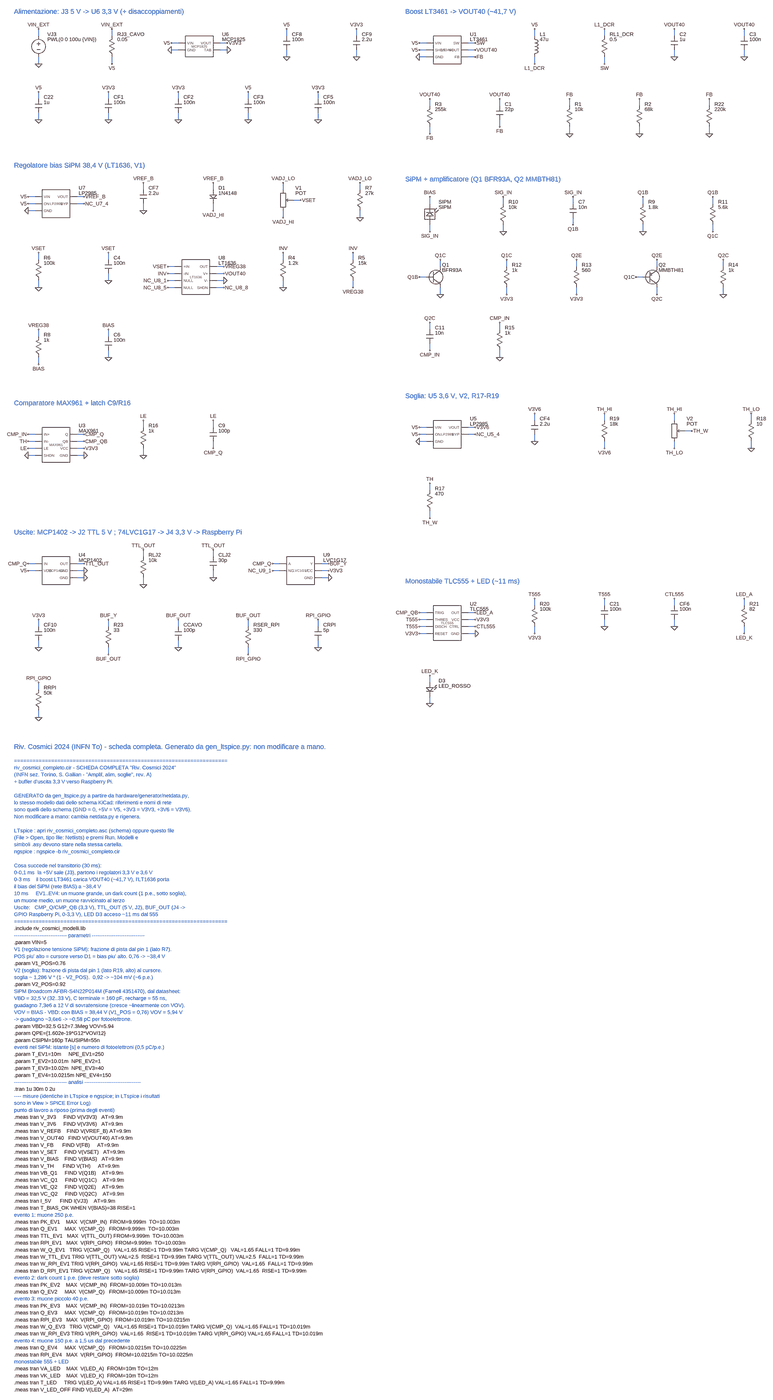
[diagram p0: schematic riv_cosmici_completo.asc, whole sheet]
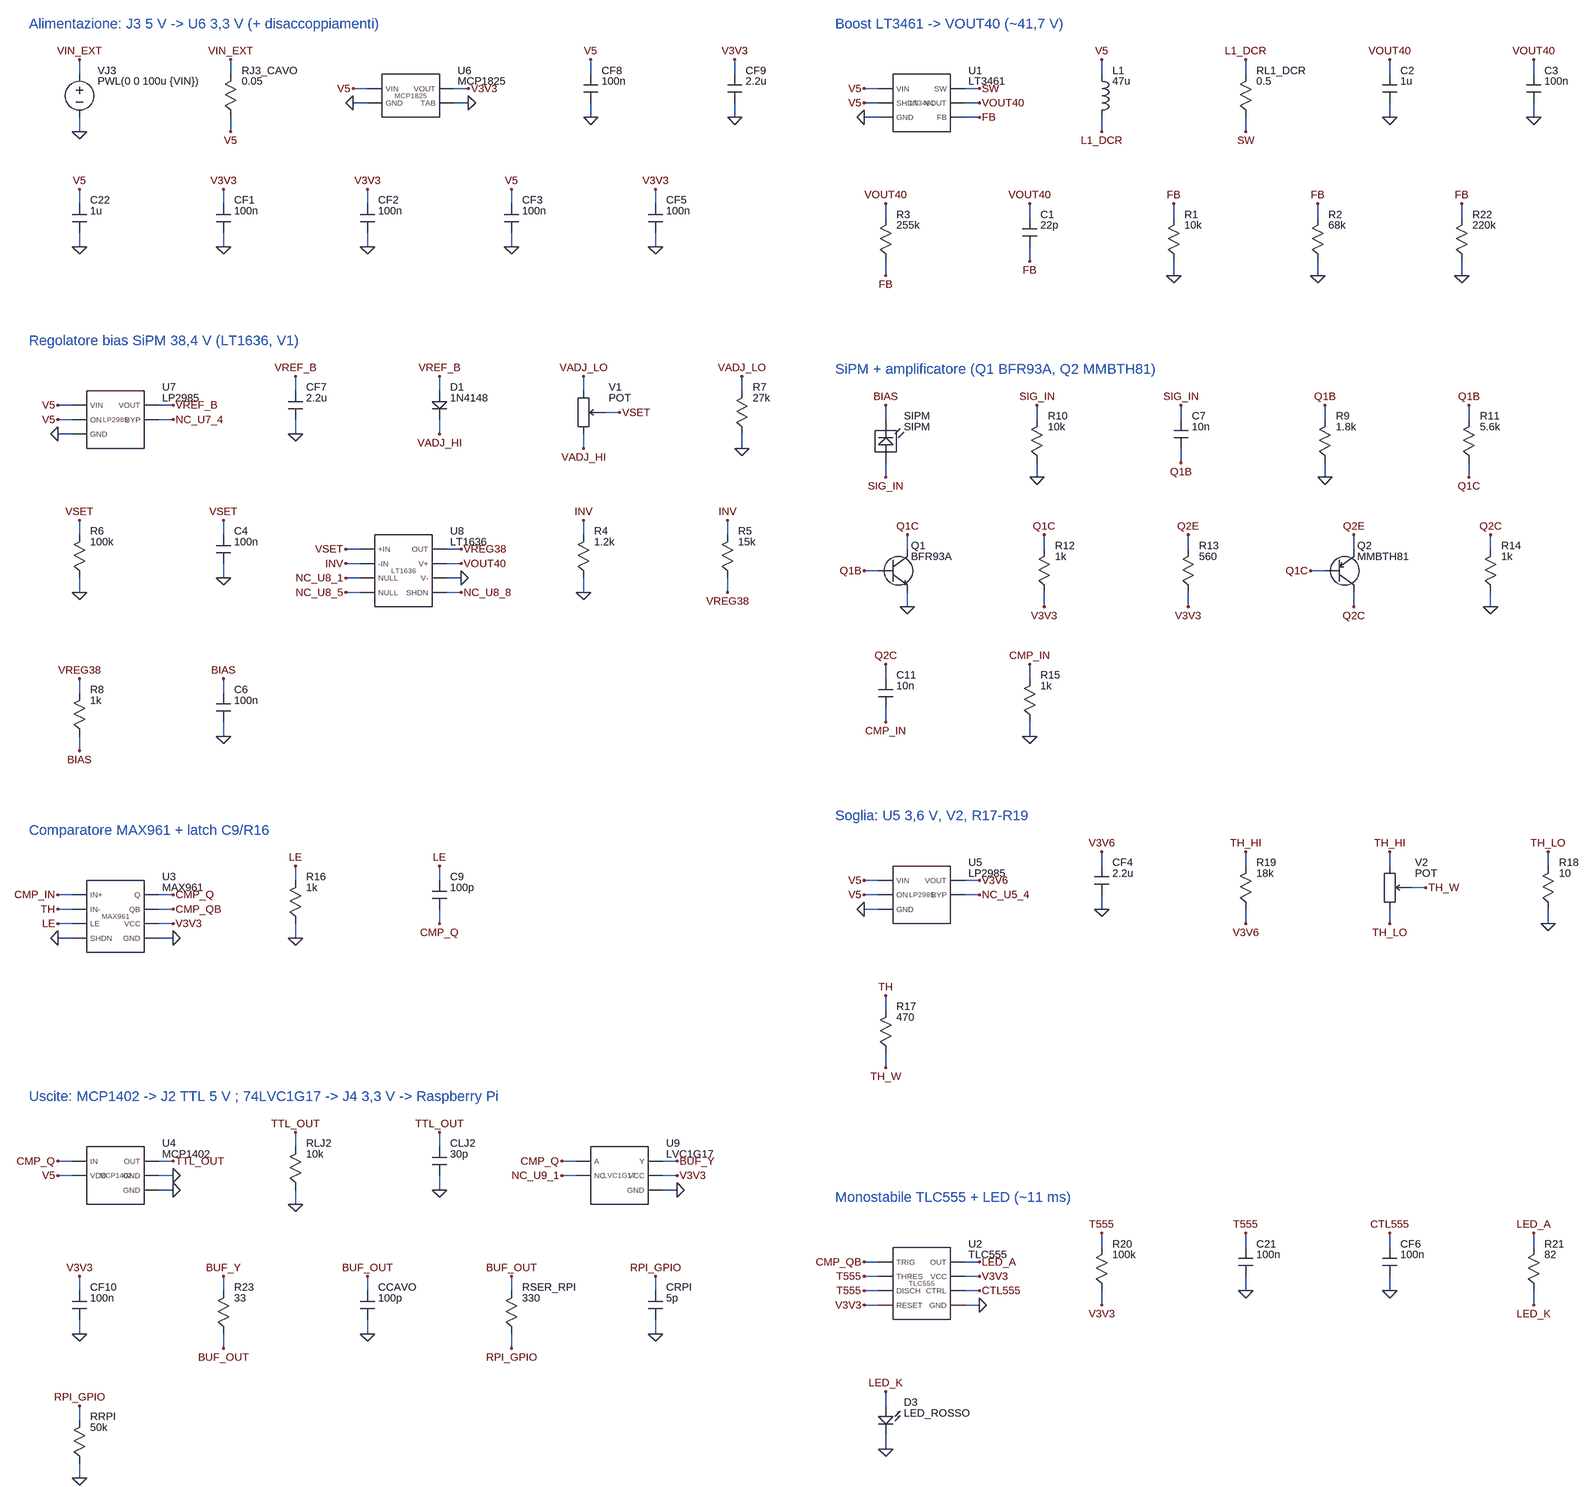
[diagram p1: schematic riv_cosmici_completo.asc, part, row 1 of 2, column 1 of 1]
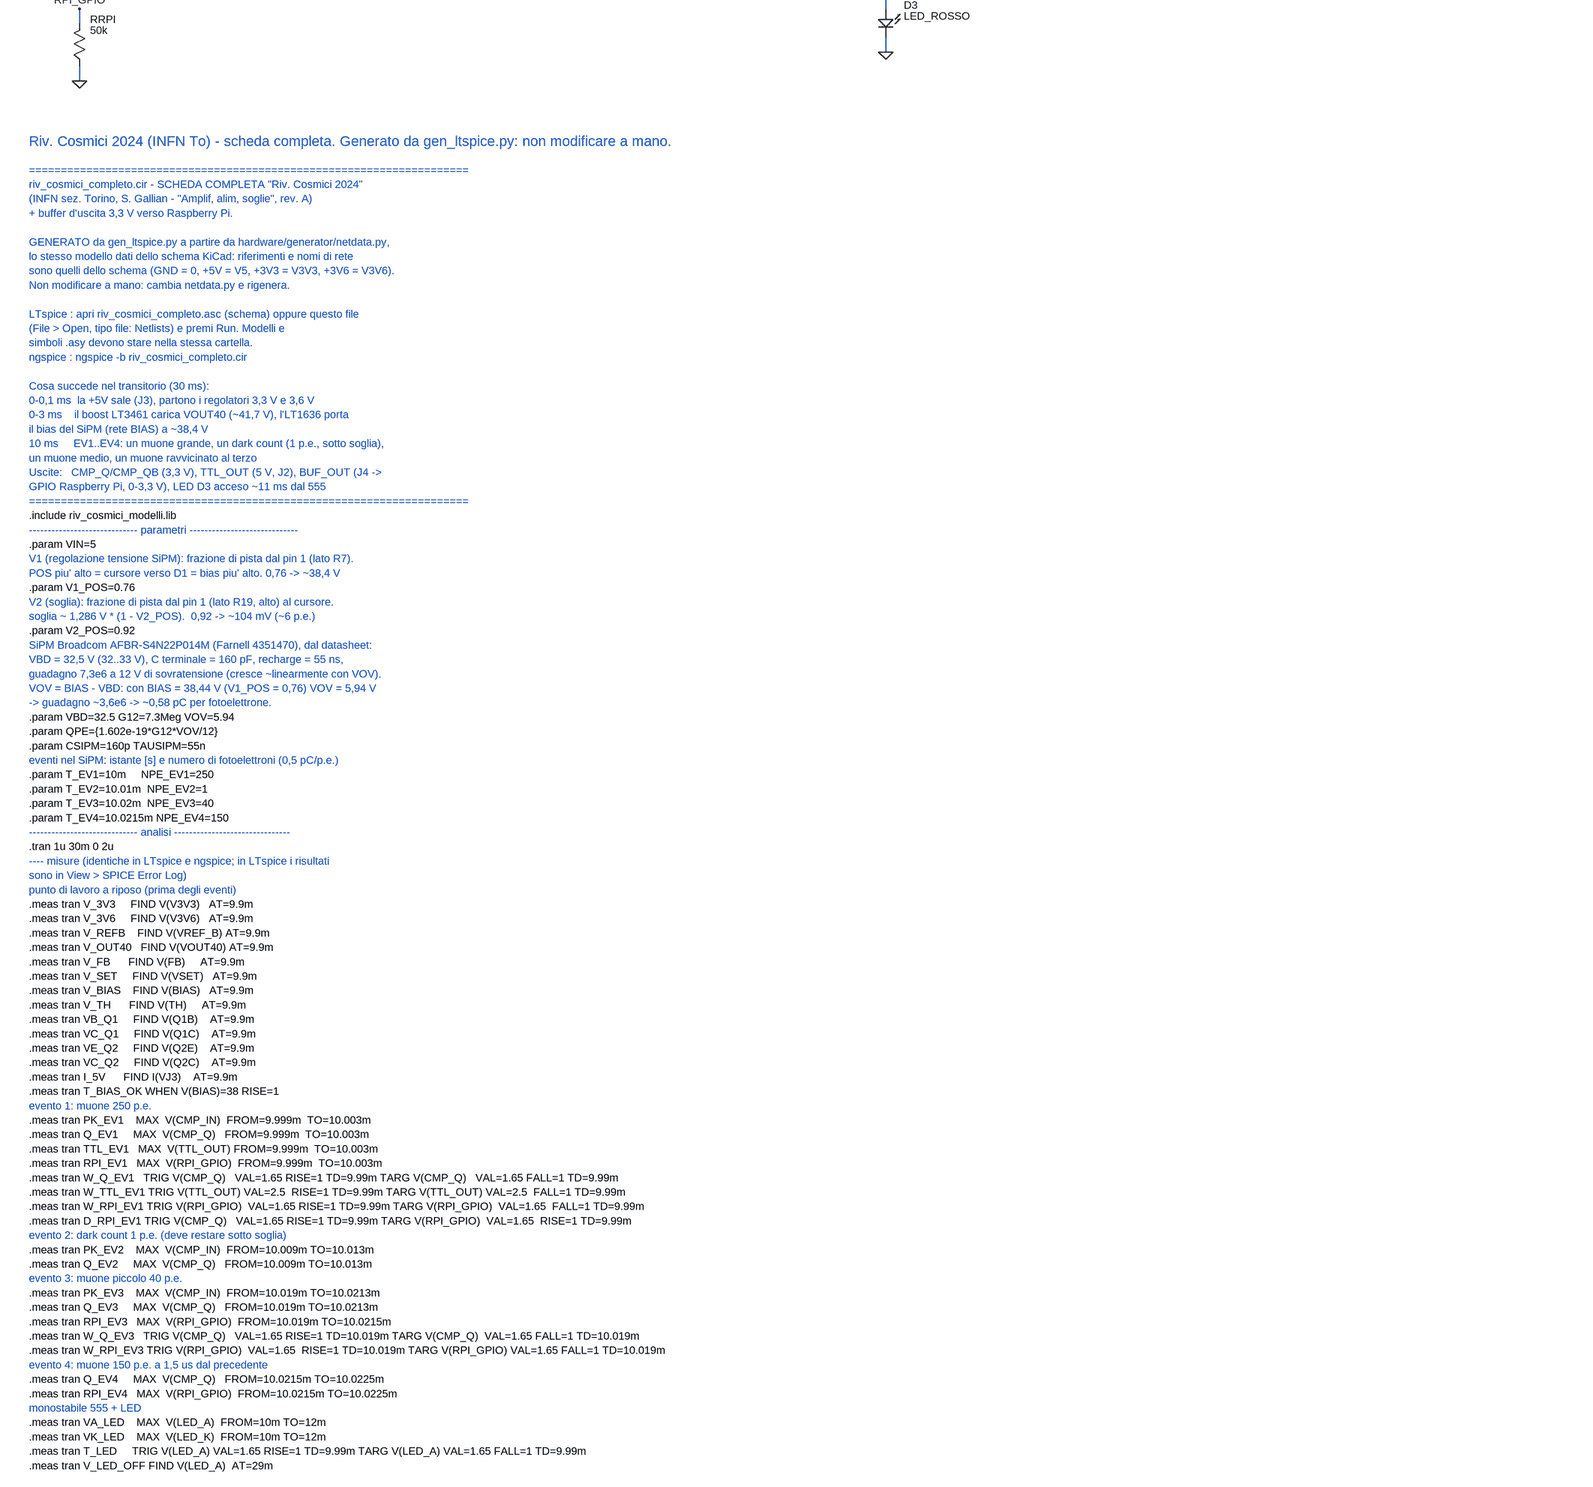
[diagram p2: schematic riv_cosmici_completo.asc, part, row 2 of 2, column 1 of 1]
riv_cosmici_completo.asc, the LTspice schematic file:
Version 4
SHEET 1 4608 6296
WIRE 112 112 112 80
WIRE 112 208 112 240
WIRE 448 112 448 80
WIRE 448 208 448 240
WIRE 752 144 720 144
WIRE 752 176 720 176
WIRE 944 144 976 144
WIRE 944 176 976 176
WIRE 1248 112 1248 80
WIRE 1248 176 1248 208
WIRE 1568 112 1568 80
WIRE 1568 176 1568 208
WIRE 112 400 112 368
WIRE 112 464 112 496
WIRE 432 400 432 368
WIRE 432 464 432 496
WIRE 752 400 752 368
WIRE 752 464 752 496
WIRE 1072 400 1072 368
WIRE 1072 464 1072 496
WIRE 1392 400 1392 368
WIRE 1392 464 1392 496
WIRE 2528 144 2560 144
WIRE 2336 208 2304 208
WIRE 2528 208 2560 208
WIRE 2336 176 2304 176
WIRE 2528 176 2560 176
WIRE 2336 144 2304 144
WIRE 2832 112 2832 80
WIRE 2832 208 2832 240
WIRE 3152 112 3152 80
WIRE 3152 208 3152 240
WIRE 3472 112 3472 80
WIRE 3472 176 3472 208
WIRE 3792 112 3792 80
WIRE 3792 176 3792 208
WIRE 2352 432 2352 400
WIRE 2352 528 2352 560
WIRE 2672 432 2672 400
WIRE 2672 496 2672 528
WIRE 2992 432 2992 400
WIRE 2992 528 2992 560
WIRE 3312 432 3312 400
WIRE 3312 528 3312 560
WIRE 3632 432 3632 400
WIRE 3632 528 3632 560
WIRE 96 928 64 928
WIRE 96 992 64 992
WIRE 96 960 64 960
WIRE 288 960 320 960
WIRE 288 928 320 928
WIRE 592 896 592 864
WIRE 592 960 592 992
WIRE 912 896 912 864
WIRE 912 960 912 992
WIRE 1232 896 1232 864
WIRE 1280 944 1312 944
WIRE 1232 992 1232 1024
WIRE 1584 896 1584 864
WIRE 1584 992 1584 1024
WIRE 112 1216 112 1184
WIRE 112 1312 112 1344
WIRE 432 1216 432 1184
WIRE 432 1280 432 1312
WIRE 736 1312 704 1312
WIRE 736 1280 704 1280
WIRE 736 1248 704 1248
WIRE 928 1312 960 1312
WIRE 736 1344 704 1344
WIRE 928 1248 960 1248
WIRE 928 1280 960 1280
WIRE 928 1344 960 1344
WIRE 1232 1216 1232 1184
WIRE 1232 1312 1232 1344
WIRE 1552 1216 1552 1184
WIRE 1552 1312 1552 1344
WIRE 112 1568 112 1536
WIRE 112 1664 112 1696
WIRE 432 1568 432 1536
WIRE 432 1632 432 1664
WIRE 2352 1056 2352 1088
WIRE 2352 960 2352 928
WIRE 2688 960 2688 928
WIRE 2688 1056 2688 1088
WIRE 3008 960 3008 928
WIRE 3008 1024 3008 1056
WIRE 3328 960 3328 928
WIRE 3328 1056 3328 1088
WIRE 3648 960 3648 928
WIRE 3648 1056 3648 1088
WIRE 2400 1248 2400 1216
WIRE 2336 1296 2304 1296
WIRE 2400 1344 2400 1376
WIRE 2704 1248 2704 1216
WIRE 2704 1344 2704 1376
WIRE 3024 1248 3024 1216
WIRE 3024 1344 3024 1376
WIRE 3392 1344 3392 1376
WIRE 3328 1296 3296 1296
WIRE 3392 1248 3392 1216
WIRE 3696 1248 3696 1216
WIRE 3696 1344 3696 1376
WIRE 2352 1536 2352 1504
WIRE 2352 1600 2352 1632
WIRE 2672 1536 2672 1504
WIRE 2672 1632 2672 1664
WIRE 2336 2096 2304 2096
WIRE 2336 2160 2304 2160
WIRE 2336 2128 2304 2128
WIRE 2528 2128 2560 2128
WIRE 2528 2096 2560 2096
WIRE 2832 2064 2832 2032
WIRE 2832 2128 2832 2160
WIRE 3152 2064 3152 2032
WIRE 3152 2160 3152 2192
WIRE 3472 2064 3472 2032
WIRE 3520 2112 3552 2112
WIRE 3472 2160 3472 2192
WIRE 3824 2064 3824 2032
WIRE 3824 2160 3824 2192
WIRE 2352 2384 2352 2352
WIRE 2352 2480 2352 2512
WIRE 96 2128 64 2128
WIRE 96 2160 64 2160
WIRE 96 2224 64 2224
WIRE 96 2192 64 2192
WIRE 288 2224 320 2224
WIRE 288 2128 320 2128
WIRE 288 2160 320 2160
WIRE 288 2192 320 2192
WIRE 592 2096 592 2064
WIRE 592 2192 592 2224
WIRE 912 2096 912 2064
WIRE 912 2160 912 2192
WIRE 288 2752 320 2752
WIRE 96 2752 64 2752
WIRE 96 2720 64 2720
WIRE 288 2784 320 2784
WIRE 288 2720 320 2720
WIRE 592 2688 592 2656
WIRE 592 2784 592 2816
WIRE 912 2688 912 2656
WIRE 912 2752 912 2784
WIRE 1216 2752 1184 2752
WIRE 1216 2720 1184 2720
WIRE 1408 2784 1440 2784
WIRE 1408 2720 1440 2720
WIRE 1408 2752 1440 2752
WIRE 112 3008 112 2976
WIRE 112 3072 112 3104
WIRE 432 3008 432 2976
WIRE 432 3104 432 3136
WIRE 752 3008 752 2976
WIRE 752 3072 752 3104
WIRE 1072 3008 1072 2976
WIRE 1072 3104 1072 3136
WIRE 1392 3008 1392 2976
WIRE 1392 3072 1392 3104
WIRE 112 3296 112 3264
WIRE 112 3392 112 3424
WIRE 2528 3040 2560 3040
WIRE 2336 2944 2304 2944
WIRE 2528 2944 2560 2944
WIRE 2336 3040 2304 3040
WIRE 2528 3008 2560 3008
WIRE 2336 2976 2304 2976
WIRE 2336 3008 2304 3008
WIRE 2528 2976 2560 2976
WIRE 2832 2912 2832 2880
WIRE 2832 3008 2832 3040
WIRE 3152 2912 3152 2880
WIRE 3152 2976 3152 3008
WIRE 3472 2912 3472 2880
WIRE 3472 2976 3472 3008
WIRE 3792 2912 3792 2880
WIRE 3792 3008 3792 3040
WIRE 2352 3264 2352 3232
WIRE 2352 3328 2352 3360
FLAG 112 80 VIN_EXT
FLAG 112 240 0
FLAG 448 80 VIN_EXT
FLAG 448 240 V5
FLAG 720 144 V5
FLAG 720 176 0
FLAG 976 144 V3V3
FLAG 976 176 0
FLAG 1248 80 V5
FLAG 1248 208 0
FLAG 1568 80 V3V3
FLAG 1568 208 0
FLAG 112 368 V5
FLAG 112 496 0
FLAG 432 368 V3V3
FLAG 432 496 0
FLAG 752 368 V3V3
FLAG 752 496 0
FLAG 1072 368 V5
FLAG 1072 496 0
FLAG 1392 368 V3V3
FLAG 1392 496 0
FLAG 2560 144 SW
FLAG 2304 208 0
FLAG 2560 208 FB
FLAG 2304 176 V5
FLAG 2560 176 VOUT40
FLAG 2304 144 V5
FLAG 2832 80 V5
FLAG 2832 240 L1_DCR
FLAG 3152 80 L1_DCR
FLAG 3152 240 SW
FLAG 3472 80 VOUT40
FLAG 3472 208 0
FLAG 3792 80 VOUT40
FLAG 3792 208 0
FLAG 2352 400 VOUT40
FLAG 2352 560 FB
FLAG 2672 400 VOUT40
FLAG 2672 528 FB
FLAG 2992 400 FB
FLAG 2992 560 0
FLAG 3312 400 FB
FLAG 3312 560 0
FLAG 3632 400 FB
FLAG 3632 560 0
FLAG 64 928 V5
FLAG 64 992 0
FLAG 64 960 V5
FLAG 320 960 NC_U7_4
FLAG 320 928 VREF_B
FLAG 592 864 VREF_B
FLAG 592 992 0
FLAG 912 864 VREF_B
FLAG 912 992 VADJ_HI
FLAG 1232 864 VADJ_LO
FLAG 1312 944 VSET
FLAG 1232 1024 VADJ_HI
FLAG 1584 864 VADJ_LO
FLAG 1584 1024 0
FLAG 112 1184 VSET
FLAG 112 1344 0
FLAG 432 1184 VSET
FLAG 432 1312 0
FLAG 704 1312 NC_U8_1
FLAG 704 1280 INV
FLAG 704 1248 VSET
FLAG 960 1312 0
FLAG 704 1344 NC_U8_5
FLAG 960 1248 VREG38
FLAG 960 1280 VOUT40
FLAG 960 1344 NC_U8_8
FLAG 1232 1184 INV
FLAG 1232 1344 0
FLAG 1552 1184 INV
FLAG 1552 1344 VREG38
FLAG 112 1536 VREG38
FLAG 112 1696 BIAS
FLAG 432 1536 BIAS
FLAG 432 1664 0
FLAG 2352 1088 SIG_IN
FLAG 2352 928 BIAS
FLAG 2688 928 SIG_IN
FLAG 2688 1088 0
FLAG 3008 928 SIG_IN
FLAG 3008 1056 Q1B
FLAG 3328 928 Q1B
FLAG 3328 1088 0
FLAG 3648 928 Q1B
FLAG 3648 1088 Q1C
FLAG 2400 1216 Q1C
FLAG 2304 1296 Q1B
FLAG 2400 1376 0
FLAG 2704 1216 Q1C
FLAG 2704 1376 V3V3
FLAG 3024 1216 Q2E
FLAG 3024 1376 V3V3
FLAG 3392 1376 Q2C
FLAG 3296 1296 Q1C
FLAG 3392 1216 Q2E
FLAG 3696 1216 Q2C
FLAG 3696 1376 0
FLAG 2352 1504 Q2C
FLAG 2352 1632 CMP_IN
FLAG 2672 1504 CMP_IN
FLAG 2672 1664 0
FLAG 2304 2096 V5
FLAG 2304 2160 0
FLAG 2304 2128 V5
FLAG 2560 2128 NC_U5_4
FLAG 2560 2096 V3V6
FLAG 2832 2032 V3V6
FLAG 2832 2160 0
FLAG 3152 2032 TH_HI
FLAG 3152 2192 V3V6
FLAG 3472 2032 TH_HI
FLAG 3552 2112 TH_W
FLAG 3472 2192 TH_LO
FLAG 3824 2032 TH_LO
FLAG 3824 2192 0
FLAG 2352 2352 TH
FLAG 2352 2512 TH_W
FLAG 64 2128 CMP_IN
FLAG 64 2160 TH
FLAG 64 2224 0
FLAG 64 2192 LE
FLAG 320 2224 0
FLAG 320 2128 CMP_Q
FLAG 320 2160 CMP_QB
FLAG 320 2192 V3V3
FLAG 592 2064 LE
FLAG 592 2224 0
FLAG 912 2064 LE
FLAG 912 2192 CMP_Q
FLAG 320 2752 0
FLAG 64 2752 V5
FLAG 64 2720 CMP_Q
FLAG 320 2784 0
FLAG 320 2720 TTL_OUT
FLAG 592 2656 TTL_OUT
FLAG 592 2816 0
FLAG 912 2656 TTL_OUT
FLAG 912 2784 0
FLAG 1184 2752 NC_U9_1
FLAG 1184 2720 CMP_Q
FLAG 1440 2784 0
FLAG 1440 2720 BUF_Y
FLAG 1440 2752 V3V3
FLAG 112 2976 V3V3
FLAG 112 3104 0
FLAG 432 2976 BUF_Y
FLAG 432 3136 BUF_OUT
FLAG 752 2976 BUF_OUT
FLAG 752 3104 0
FLAG 1072 2976 BUF_OUT
FLAG 1072 3136 RPI_GPIO
FLAG 1392 2976 RPI_GPIO
FLAG 1392 3104 0
FLAG 112 3264 RPI_GPIO
FLAG 112 3424 0
FLAG 2560 3040 0
FLAG 2304 2944 CMP_QB
FLAG 2560 2944 LED_A
FLAG 2304 3040 V3V3
FLAG 2560 3008 CTL555
FLAG 2304 2976 T555
FLAG 2304 3008 T555
FLAG 2560 2976 V3V3
FLAG 2832 2880 T555
FLAG 2832 3040 V3V3
FLAG 3152 2880 T555
FLAG 3152 3008 0
FLAG 3472 2880 CTL555
FLAG 3472 3008 0
FLAG 3792 2880 LED_A
FLAG 3792 3040 LED_K
FLAG 2352 3232 LED_K
FLAG 2352 3360 0
SYMBOL riv_V 96 112 R0
SYMATTR InstName VJ3
SYMATTR Value PWL(0 0 100u {VIN})
SYMBOL riv_R 432 112 R0
SYMATTR InstName RJ3_CAVO
SYMATTR Value 0.05
SYMBOL riv_MCP1825 752 112 R0
SYMATTR InstName U6
SYMATTR Value MCP1825
SYMBOL riv_C 1232 112 R0
SYMATTR InstName CF8
SYMATTR Value 100n
SYMBOL riv_C 1552 112 R0
SYMATTR InstName CF9
SYMATTR Value 2.2u
SYMBOL riv_C 96 400 R0
SYMATTR InstName C22
SYMATTR Value 1u
SYMBOL riv_C 416 400 R0
SYMATTR InstName CF1
SYMATTR Value 100n
SYMBOL riv_C 736 400 R0
SYMATTR InstName CF2
SYMATTR Value 100n
SYMBOL riv_C 1056 400 R0
SYMATTR InstName CF3
SYMATTR Value 100n
SYMBOL riv_C 1376 400 R0
SYMATTR InstName CF5
SYMATTR Value 100n
SYMBOL riv_LT3461 2336 112 R0
SYMATTR InstName U1
SYMATTR Value LT3461
SYMBOL riv_L 2816 112 R0
SYMATTR InstName L1
SYMATTR Value 47u
SYMBOL riv_R 3136 112 R0
SYMATTR InstName RL1_DCR
SYMATTR Value 0.5
SYMBOL riv_C 3456 112 R0
SYMATTR InstName C2
SYMATTR Value 1u
SYMBOL riv_C 3776 112 R0
SYMATTR InstName C3
SYMATTR Value 100n
SYMBOL riv_R 2336 432 R0
SYMATTR InstName R3
SYMATTR Value 255k
SYMBOL riv_C 2656 432 R0
SYMATTR InstName C1
SYMATTR Value 22p
SYMBOL riv_R 2976 432 R0
SYMATTR InstName R1
SYMATTR Value 10k
SYMBOL riv_R 3296 432 R0
SYMATTR InstName R2
SYMATTR Value 68k
SYMBOL riv_R 3616 432 R0
SYMATTR InstName R22
SYMATTR Value 220k
SYMBOL riv_LP2985 96 896 R0
SYMATTR InstName U7
SYMATTR Value LP2985
SYMBOL riv_C 576 896 R0
SYMATTR InstName CF7
SYMATTR Value 2.2u
SYMBOL riv_D 896 896 R0
SYMATTR InstName D1
SYMATTR Value 1N4148
SYMBOL riv_POT 1216 896 R0
SYMATTR InstName V1
SYMATTR Value POT
SYMATTR SpiceLine R=10k POS={V1_POS}
SYMBOL riv_R 1568 896 R0
SYMATTR InstName R7
SYMATTR Value 27k
SYMBOL riv_R 96 1216 R0
SYMATTR InstName R6
SYMATTR Value 100k
SYMBOL riv_C 416 1216 R0
SYMATTR InstName C4
SYMATTR Value 100n
SYMBOL riv_LT1636 736 1216 R0
SYMATTR InstName U8
SYMATTR Value LT1636
SYMBOL riv_R 1216 1216 R0
SYMATTR InstName R4
SYMATTR Value 1.2k
SYMBOL riv_R 1536 1216 R0
SYMATTR InstName R5
SYMATTR Value 15k
SYMBOL riv_R 96 1568 R0
SYMATTR InstName R8
SYMATTR Value 1k
SYMBOL riv_C 416 1568 R0
SYMATTR InstName C6
SYMATTR Value 100n
SYMBOL riv_SIPM 2336 960 R0
SYMATTR InstName SIPM
SYMATTR Value SIPM
SYMATTR SpiceLine NPE1={NPE_EV1} T1={T_EV1} NPE2={NPE_EV2} T2={T_EV2} NPE3={NPE_EV3} T3={T_EV3} NPE4={NPE_EV4} T4={T_EV4} CSIPM={CSIPM} QPE={QPE} TAU={TAUSIPM}
SYMBOL riv_R 2672 960 R0
SYMATTR InstName R10
SYMATTR Value 10k
SYMBOL riv_C 2992 960 R0
SYMATTR InstName C7
SYMATTR Value 10n
SYMBOL riv_R 3312 960 R0
SYMATTR InstName R9
SYMATTR Value 1.8k
SYMBOL riv_R 3632 960 R0
SYMATTR InstName R11
SYMATTR Value 5.6k
SYMBOL riv_NPN 2336 1248 R0
SYMATTR InstName Q1
SYMATTR Value BFR93A
SYMBOL riv_R 2688 1248 R0
SYMATTR InstName R12
SYMATTR Value 1k
SYMBOL riv_R 3008 1248 R0
SYMATTR InstName R13
SYMATTR Value 560
SYMBOL riv_PNP 3328 1248 R0
SYMATTR InstName Q2
SYMATTR Value MMBTH81
SYMBOL riv_R 3680 1248 R0
SYMATTR InstName R14
SYMATTR Value 1k
SYMBOL riv_C 2336 1536 R0
SYMATTR InstName C11
SYMATTR Value 10n
SYMBOL riv_R 2656 1536 R0
SYMATTR InstName R15
SYMATTR Value 1k
SYMBOL riv_LP2985 2336 2064 R0
SYMATTR InstName U5
SYMATTR Value LP2985
SYMBOL riv_C 2816 2064 R0
SYMATTR InstName CF4
SYMATTR Value 2.2u
SYMBOL riv_R 3136 2064 R0
SYMATTR InstName R19
SYMATTR Value 18k
SYMBOL riv_POT 3456 2064 R0
SYMATTR InstName V2
SYMATTR Value POT
SYMATTR SpiceLine R=10k POS={V2_POS}
SYMBOL riv_R 3808 2064 R0
SYMATTR InstName R18
SYMATTR Value 10
SYMBOL riv_R 2336 2384 R0
SYMATTR InstName R17
SYMATTR Value 470
SYMBOL riv_MAX961 96 2096 R0
SYMATTR InstName U3
SYMATTR Value MAX961
SYMBOL riv_R 576 2096 R0
SYMATTR InstName R16
SYMATTR Value 1k
SYMBOL riv_C 896 2096 R0
SYMATTR InstName C9
SYMATTR Value 100p
SYMBOL riv_MCP1402 96 2688 R0
SYMATTR InstName U4
SYMATTR Value MCP1402
SYMBOL riv_R 576 2688 R0
SYMATTR InstName RLJ2
SYMATTR Value 10k
SYMBOL riv_C 896 2688 R0
SYMATTR InstName CLJ2
SYMATTR Value 30p
SYMBOL riv_LVC1G17 1216 2688 R0
SYMATTR InstName U9
SYMATTR Value LVC1G17
SYMBOL riv_C 96 3008 R0
SYMATTR InstName CF10
SYMATTR Value 100n
SYMBOL riv_R 416 3008 R0
SYMATTR InstName R23
SYMATTR Value 33
SYMBOL riv_C 736 3008 R0
SYMATTR InstName CCAVO
SYMATTR Value 100p
SYMBOL riv_R 1056 3008 R0
SYMATTR InstName RSER_RPI
SYMATTR Value 330
SYMBOL riv_C 1376 3008 R0
SYMATTR InstName CRPI
SYMATTR Value 5p
SYMBOL riv_R 96 3296 R0
SYMATTR InstName RRPI
SYMATTR Value 50k
SYMBOL riv_TLC555 2336 2912 R0
SYMATTR InstName U2
SYMATTR Value TLC555
SYMBOL riv_R 2816 2912 R0
SYMATTR InstName R20
SYMATTR Value 100k
SYMBOL riv_C 3136 2912 R0
SYMATTR InstName C21
SYMATTR Value 100n
SYMBOL riv_C 3456 2912 R0
SYMATTR InstName CF6
SYMATTR Value 100n
SYMBOL riv_R 3776 2912 R0
SYMATTR InstName R21
SYMATTR Value 82
SYMBOL riv_LED 2336 3264 R0
SYMATTR InstName D3
SYMATTR Value LED_ROSSO
TEXT 0 0 Left 3 ;Alimentazione: J3 5 V -> U6 3,3 V (+ disaccoppiamenti)
TEXT 2240 0 Left 3 ;Boost LT3461 -> VOUT40 (~41,7 V)
TEXT 0 784 Left 3 ;Regolatore bias SiPM 38,4 V (LT1636, V1)
TEXT 2240 848 Left 3 ;SiPM + amplificatore (Q1 BFR93A, Q2 MMBTH81)
TEXT 2240 1952 Left 3 ;Soglia: U5 3,6 V, V2, R17-R19
TEXT 0 1984 Left 3 ;Comparatore MAX961 + latch C9/R16
TEXT 0 2576 Left 3 ;Uscite: MCP1402 -> J2 TTL 5 V ; 74LVC1G17 -> J4 3,3 V -> Raspberry Pi
TEXT 2240 2800 Left 3 ;Monostabile TLC555 + LED (~11 ms)
TEXT 0 3960 Left 3 ;Riv. Cosmici 2024 (INFN To) - scheda completa. Generato da gen_ltspice.py: non modificare a mano.
TEXT 0 4024 Left 2 ;=====================================================================
TEXT 0 4056 Left 2 ;riv_cosmici_completo.cir - SCHEDA COMPLETA "Riv. Cosmici 2024"
TEXT 0 4088 Left 2 ;(INFN sez. Torino, S. Gallian - "Amplif, alim, soglie", rev. A)
TEXT 0 4120 Left 2 ;+ buffer d'uscita 3,3 V verso Raspberry Pi.
TEXT 0 4152 Left 2 ;
TEXT 0 4184 Left 2 ;GENERATO da gen_ltspice.py a partire da hardware/generator/netdata.py,
TEXT 0 4216 Left 2 ;lo stesso modello dati dello schema KiCad: riferimenti e nomi di rete
TEXT 0 4248 Left 2 ;sono quelli dello schema (GND = 0, +5V = V5, +3V3 = V3V3, +3V6 = V3V6).
TEXT 0 4280 Left 2 ;Non modificare a mano: cambia netdata.py e rigenera.
TEXT 0 4312 Left 2 ;
TEXT 0 4344 Left 2 ;LTspice : apri riv_cosmici_completo.asc (schema) oppure questo file
TEXT 0 4376 Left 2 ;(File > Open, tipo file: Netlists) e premi Run. Modelli e
TEXT 0 4408 Left 2 ;simboli .asy devono stare nella stessa cartella.
TEXT 0 4440 Left 2 ;ngspice : ngspice -b riv_cosmici_completo.cir
TEXT 0 4472 Left 2 ;
TEXT 0 4504 Left 2 ;Cosa succede nel transitorio (30 ms):
TEXT 0 4536 Left 2 ;0-0,1 ms  la +5V sale (J3), partono i regolatori 3,3 V e 3,6 V
TEXT 0 4568 Left 2 ;0-3 ms    il boost LT3461 carica VOUT40 (~41,7 V), l'LT1636 porta
TEXT 0 4600 Left 2 ;il bias del SiPM (rete BIAS) a ~38,4 V
TEXT 0 4632 Left 2 ;10 ms     EV1..EV4: un muone grande, un dark count (1 p.e., sotto soglia),
TEXT 0 4664 Left 2 ;un muone medio, un muone ravvicinato al terzo
TEXT 0 4696 Left 2 ;Uscite:   CMP_Q/CMP_QB (3,3 V), TTL_OUT (5 V, J2), BUF_OUT (J4 ->
TEXT 0 4728 Left 2 ;GPIO Raspberry Pi, 0-3,3 V), LED D3 acceso ~11 ms dal 555
TEXT 0 4760 Left 2 ;=====================================================================
TEXT 0 4792 Left 2 !.include riv_cosmici_modelli.lib
TEXT 0 4824 Left 2 ;----------------------------- parametri -----------------------------
TEXT 0 4856 Left 2 !.param VIN=5
TEXT 0 4888 Left 2 ;V1 (regolazione tensione SiPM): frazione di pista dal pin 1 (lato R7).
TEXT 0 4920 Left 2 ;POS piu' alto = cursore verso D1 = bias piu' alto. 0,76 -> ~38,4 V
TEXT 0 4952 Left 2 !.param V1_POS=0.76
TEXT 0 4984 Left 2 ;V2 (soglia): frazione di pista dal pin 1 (lato R19, alto) al cursore.
TEXT 0 5016 Left 2 ;soglia ~ 1,286 V * (1 - V2_POS).  0,92 -> ~104 mV (~6 p.e.)
TEXT 0 5048 Left 2 !.param V2_POS=0.92
TEXT 0 5080 Left 2 ;SiPM Broadcom AFBR-S4N22P014M (Farnell 4351470), dal datasheet:
TEXT 0 5112 Left 2 ;VBD = 32,5 V (32..33 V), C terminale = 160 pF, recharge = 55 ns,
TEXT 0 5144 Left 2 ;guadagno 7,3e6 a 12 V di sovratensione (cresce ~linearmente con VOV).
TEXT 0 5176 Left 2 ;VOV = BIAS - VBD: con BIAS = 38,44 V (V1_POS = 0,76) VOV = 5,94 V
TEXT 0 5208 Left 2 ;-> guadagno ~3,6e6 -> ~0,58 pC per fotoelettrone.
TEXT 0 5240 Left 2 !.param VBD=32.5 G12=7.3Meg VOV=5.94
TEXT 0 5272 Left 2 !.param QPE={1.602e-19*G12*VOV/12}
TEXT 0 5304 Left 2 !.param CSIPM=160p TAUSIPM=55n
TEXT 0 5336 Left 2 ;eventi nel SiPM: istante [s] e numero di fotoelettroni (0,5 pC/p.e.)
TEXT 0 5368 Left 2 !.param T_EV1=10m     NPE_EV1=250
TEXT 0 5400 Left 2 !.param T_EV2=10.01m  NPE_EV2=1
TEXT 0 5432 Left 2 !.param T_EV3=10.02m  NPE_EV3=40
TEXT 0 5464 Left 2 !.param T_EV4=10.0215m NPE_EV4=150
TEXT 0 5496 Left 2 ;----------------------------- analisi -------------------------------
TEXT 0 5528 Left 2 !.tran 1u 30m 0 2u
TEXT 0 5560 Left 2 ;---- misure (identiche in LTspice e ngspice; in LTspice i risultati
TEXT 0 5592 Left 2 ;sono in View > SPICE Error Log)
TEXT 0 5624 Left 2 ;punto di lavoro a riposo (prima degli eventi)
TEXT 0 5656 Left 2 !.meas tran V_3V3     FIND V(V3V3)   AT=9.9m
TEXT 0 5688 Left 2 !.meas tran V_3V6     FIND V(V3V6)   AT=9.9m
TEXT 0 5720 Left 2 !.meas tran V_REFB    FIND V(VREF_B) AT=9.9m
TEXT 0 5752 Left 2 !.meas tran V_OUT40   FIND V(VOUT40) AT=9.9m
TEXT 0 5784 Left 2 !.meas tran V_FB      FIND V(FB)     AT=9.9m
TEXT 0 5816 Left 2 !.meas tran V_SET     FIND V(VSET)   AT=9.9m
TEXT 0 5848 Left 2 !.meas tran V_BIAS    FIND V(BIAS)   AT=9.9m
TEXT 0 5880 Left 2 !.meas tran V_TH      FIND V(TH)     AT=9.9m
TEXT 0 5912 Left 2 !.meas tran VB_Q1     FIND V(Q1B)    AT=9.9m
TEXT 0 5944 Left 2 !.meas tran VC_Q1     FIND V(Q1C)    AT=9.9m
TEXT 0 5976 Left 2 !.meas tran VE_Q2     FIND V(Q2E)    AT=9.9m
TEXT 0 6008 Left 2 !.meas tran VC_Q2     FIND V(Q2C)    AT=9.9m
TEXT 0 6040 Left 2 !.meas tran I_5V      FIND I(VJ3)    AT=9.9m
TEXT 0 6072 Left 2 !.meas tran T_BIAS_OK WHEN V(BIAS)=38 RISE=1
TEXT 0 6104 Left 2 ;evento 1: muone 250 p.e.
TEXT 0 6136 Left 2 !.meas tran PK_EV1    MAX  V(CMP_IN)  FROM=9.999m  TO=10.003m
TEXT 0 6168 Left 2 !.meas tran Q_EV1     MAX  V(CMP_Q)   FROM=9.999m  TO=10.003m
TEXT 0 6200 Left 2 !.meas tran TTL_EV1   MAX  V(TTL_OUT) FROM=9.999m  TO=10.003m
TEXT 0 6232 Left 2 !.meas tran RPI_EV1   MAX  V(RPI_GPIO)  FROM=9.999m  TO=10.003m
TEXT 0 6264 Left 2 !.meas tran W_Q_EV1   TRIG V(CMP_Q)   VAL=1.65 RISE=1 TD=9.99m TARG V(CMP_Q)   VAL=1.65 FALL=1 TD=9.99m
TEXT 0 6296 Left 2 !.meas tran W_TTL_EV1 TRIG V(TTL_OUT) VAL=2.5  RISE=1 TD=9.99m TARG V(TTL_OUT) VAL=2.5  FALL=1 TD=9.99m
TEXT 0 6328 Left 2 !.meas tran W_RPI_EV1 TRIG V(RPI_GPIO)  VAL=1.65 RISE=1 TD=9.99m TARG V(RPI_GPIO)  VAL=1.65  FALL=1 TD=9.99m
TEXT 0 6360 Left 2 !.meas tran D_RPI_EV1 TRIG V(CMP_Q)   VAL=1.65 RISE=1 TD=9.99m TARG V(RPI_GPIO)  VAL=1.65  RISE=1 TD=9.99m
TEXT 0 6392 Left 2 ;evento 2: dark count 1 p.e. (deve restare sotto soglia)
TEXT 0 6424 Left 2 !.meas tran PK_EV2    MAX  V(CMP_IN)  FROM=10.009m TO=10.013m
TEXT 0 6456 Left 2 !.meas tran Q_EV2     MAX  V(CMP_Q)   FROM=10.009m TO=10.013m
TEXT 0 6488 Left 2 ;evento 3: muone piccolo 40 p.e.
TEXT 0 6520 Left 2 !.meas tran PK_EV3    MAX  V(CMP_IN)  FROM=10.019m TO=10.0213m
TEXT 0 6552 Left 2 !.meas tran Q_EV3     MAX  V(CMP_Q)   FROM=10.019m TO=10.0213m
TEXT 0 6584 Left 2 !.meas tran RPI_EV3   MAX  V(RPI_GPIO)  FROM=10.019m TO=10.0215m
TEXT 0 6616 Left 2 !.meas tran W_Q_EV3   TRIG V(CMP_Q)   VAL=1.65 RISE=1 TD=10.019m TARG V(CMP_Q)  VAL=1.65 FALL=1 TD=10.019m
TEXT 0 6648 Left 2 !.meas tran W_RPI_EV3 TRIG V(RPI_GPIO)  VAL=1.65  RISE=1 TD=10.019m TARG V(RPI_GPIO) VAL=1.65 FALL=1 TD=10.019m
TEXT 0 6680 Left 2 ;evento 4: muone 150 p.e. a 1,5 us dal precedente
TEXT 0 6712 Left 2 !.meas tran Q_EV4     MAX  V(CMP_Q)   FROM=10.0215m TO=10.0225m
TEXT 0 6744 Left 2 !.meas tran RPI_EV4   MAX  V(RPI_GPIO)  FROM=10.0215m TO=10.0225m
TEXT 0 6776 Left 2 ;monostabile 555 + LED
TEXT 0 6808 Left 2 !.meas tran VA_LED    MAX  V(LED_A)  FROM=10m TO=12m
TEXT 0 6840 Left 2 !.meas tran VK_LED    MAX  V(LED_K)  FROM=10m TO=12m
TEXT 0 6872 Left 2 !.meas tran T_LED     TRIG V(LED_A) VAL=1.65 RISE=1 TD=9.99m TARG V(LED_A) VAL=1.65 FALL=1 TD=9.99m
TEXT 0 6904 Left 2 !.meas tran V_LED_OFF FIND V(LED_A)  AT=29m

The netlist it stands for:
* riv_cosmici_completo.asc
VJ3 VIN_EXT 0 PWL(0 0 100u {VIN})
RJ3_CAVO VIN_EXT V5 0.05
XU6 V5 0 V3V3 0 MCP1825  ; pins VIN GND VOUT TAB
CF8 V5 0 100n
CF9 V3V3 0 2.2u
C22 V5 0 1u
CF1 V3V3 0 100n
CF2 V3V3 0 100n
CF3 V5 0 100n
CF5 V3V3 0 100n
XU1 SW 0 FB V5 VOUT40 V5 LT3461  ; pins SW GND FB SHDN VOUT VIN
L1 V5 L1_DCR 47u
RL1_DCR L1_DCR SW 0.5
C2 VOUT40 0 1u
C3 VOUT40 0 100n
R3 VOUT40 FB 255k
C1 VOUT40 FB 22p
R1 FB 0 10k
R2 FB 0 68k
R22 FB 0 220k
XU7 V5 0 V5 NC_U7_4 VREF_B LP2985  ; pins VIN GND ON BYP VOUT
CF7 VREF_B 0 2.2u
D1 VREF_B VADJ_HI 1N4148
XV1 VADJ_LO VSET VADJ_HI POT R=10k POS={V1_POS}  ; pins 1 2 3
R7 VADJ_LO 0 27k
R6 VSET 0 100k
C4 VSET 0 100n
XU8 NC_U8_1 INV VSET 0 NC_U8_5 VREG38 VOUT40 NC_U8_8 LT1636  ; pins NULL -IN +IN V- NULL OUT V+ SHDN
R4 INV 0 1.2k
R5 INV VREG38 15k
R8 VREG38 BIAS 1k
C6 BIAS 0 100n
XSIPM SIG_IN BIAS SIPM NPE1={NPE_EV1} T1={T_EV1} NPE2={NPE_EV2} T2={T_EV2} NPE3={NPE_EV3} T3={T_EV3} NPE4={NPE_EV4} T4={T_EV4} CSIPM={CSIPM} QPE={QPE} TAU={TAUSIPM}  ; pins A K
R10 SIG_IN 0 10k
C7 SIG_IN Q1B 10n
R9 Q1B 0 1.8k
R11 Q1B Q1C 5.6k
Q1 Q1C Q1B 0 0 BFR93A
R12 Q1C V3V3 1k
R13 Q2E V3V3 560
Q2 Q2C Q1C Q2E 0 MMBTH81
R14 Q2C 0 1k
C11 Q2C CMP_IN 10n
R15 CMP_IN 0 1k
XU5 V5 0 V5 NC_U5_4 V3V6 LP2985  ; pins VIN GND ON BYP VOUT
CF4 V3V6 0 2.2u
R19 TH_HI V3V6 18k
XV2 TH_HI TH_W TH_LO POT R=10k POS={V2_POS}  ; pins 1 2 3
R18 TH_LO 0 10
R17 TH TH_W 470
XU3 CMP_IN TH 0 LE 0 CMP_Q CMP_QB V3V3 MAX961  ; pins IN+ IN- SHDN LE GND Q QB VCC
R16 LE 0 1k
C9 LE CMP_Q 100p
XU4 0 V5 CMP_Q 0 TTL_OUT MCP1402  ; pins GND VDD IN GND OUT
RLJ2 TTL_OUT 0 10k
CLJ2 TTL_OUT 0 30p
XU9 NC_U9_1 CMP_Q 0 BUF_Y V3V3 LVC1G17  ; pins NC A GND Y VCC
CF10 V3V3 0 100n
R23 BUF_Y BUF_OUT 33
CCAVO BUF_OUT 0 100p
RSER_RPI BUF_OUT RPI_GPIO 330
CRPI RPI_GPIO 0 5p
RRPI RPI_GPIO 0 50k
XU2 0 CMP_QB LED_A V3V3 CTL555 T555 T555 V3V3 TLC555  ; pins GND TRIG OUT RESET CTRL THRES DISCH VCC
R20 T555 V3V3 100k
C21 T555 0 100n
CF6 CTL555 0 100n
R21 LED_A LED_K 82
D3 LED_K 0 LED_ROSSO
.model D D
.lib standard.dio
.model NPN NPN
.model PNP PNP
.lib standard.bjt
* Alimentazione: J3 5 V -> U6 3,3 V (+ disaccoppiamenti)
* Boost LT3461 -> VOUT40 (~41,7 V)
* Regolatore bias SiPM 38,4 V (LT1636, V1)
* SiPM + amplificatore (Q1 BFR93A, Q2 MMBTH81)
* Soglia: U5 3,6 V, V2, R17-R19
* Comparatore MAX961 + latch C9/R16
* Uscite: MCP1402 -> J2 TTL 5 V ; 74LVC1G17 -> J4 3,3 V -> Raspberry Pi
* Monostabile TLC555 + LED (~11 ms)
* Riv. Cosmici 2024 (INFN To) - scheda completa. Generato da gen_ltspice.py: non modificare a mano.
* =====================================================================
* riv_cosmici_completo.cir - SCHEDA COMPLETA "Riv. Cosmici 2024"
* (INFN sez. Torino, S. Gallian - "Amplif, alim, soglie", rev. A)
* + buffer d'uscita 3,3 V verso Raspberry Pi.
* GENERATO da gen_ltspice.py a partire da hardware/generator/netdata.py,
* lo stesso modello dati dello schema KiCad: riferimenti e nomi di rete
* sono quelli dello schema (GND = 0, +5V = V5, +3V3 = V3V3, +3V6 = V3V6).
* Non modificare a mano: cambia netdata.py e rigenera.
* LTspice : apri riv_cosmici_completo.asc (schema) oppure questo file
* (File > Open, tipo file: Netlists) e premi Run. Modelli e
* simboli .asy devono stare nella stessa cartella.
* ngspice : ngspice -b riv_cosmici_completo.cir
* Cosa succede nel transitorio (30 ms):
* 0-0,1 ms  la +5V sale (J3), partono i regolatori 3,3 V e 3,6 V
* 0-3 ms    il boost LT3461 carica VOUT40 (~41,7 V), l'LT1636 porta
* il bias del SiPM (rete BIAS) a ~38,4 V
* 10 ms     EV1..EV4: un muone grande, un dark count (1 p.e., sotto soglia),
* un muone medio, un muone ravvicinato al terzo
* Uscite:   CMP_Q/CMP_QB (3,3 V), TTL_OUT (5 V, J2), BUF_OUT (J4 ->
* GPIO Raspberry Pi, 0-3,3 V), LED D3 acceso ~11 ms dal 555
* =====================================================================
.include riv_cosmici_modelli.lib
* ----------------------------- parametri -----------------------------
.param VIN=5
* V1 (regolazione tensione SiPM): frazione di pista dal pin 1 (lato R7).
* POS piu' alto = cursore verso D1 = bias piu' alto. 0,76 -> ~38,4 V
.param V1_POS=0.76
* V2 (soglia): frazione di pista dal pin 1 (lato R19, alto) al cursore.
* soglia ~ 1,286 V * (1 - V2_POS).  0,92 -> ~104 mV (~6 p.e.)
.param V2_POS=0.92
* SiPM Broadcom AFBR-S4N22P014M (Farnell 4351470), dal datasheet:
* VBD = 32,5 V (32..33 V), C terminale = 160 pF, recharge = 55 ns,
* guadagno 7,3e6 a 12 V di sovratensione (cresce ~linearmente con VOV).
* VOV = BIAS - VBD: con BIAS = 38,44 V (V1_POS = 0,76) VOV = 5,94 V
* -> guadagno ~3,6e6 -> ~0,58 pC per fotoelettrone.
.param VBD=32.5 G12=7.3Meg VOV=5.94
.param QPE={1.602e-19*G12*VOV/12}
.param CSIPM=160p TAUSIPM=55n
* eventi nel SiPM: istante [s] e numero di fotoelettroni (0,5 pC/p.e.)
.param T_EV1=10m     NPE_EV1=250
.param T_EV2=10.01m  NPE_EV2=1
.param T_EV3=10.02m  NPE_EV3=40
.param T_EV4=10.0215m NPE_EV4=150
* ----------------------------- analisi -------------------------------
.tran 1u 30m 0 2u
* ---- misure (identiche in LTspice e ngspice; in LTspice i risultati
* sono in View > SPICE Error Log)
* punto di lavoro a riposo (prima degli eventi)
.meas tran V_3V3     FIND V(V3V3)   AT=9.9m
.meas tran V_3V6     FIND V(V3V6)   AT=9.9m
.meas tran V_REFB    FIND V(VREF_B) AT=9.9m
.meas tran V_OUT40   FIND V(VOUT40) AT=9.9m
.meas tran V_FB      FIND V(FB)     AT=9.9m
.meas tran V_SET     FIND V(VSET)   AT=9.9m
.meas tran V_BIAS    FIND V(BIAS)   AT=9.9m
.meas tran V_TH      FIND V(TH)     AT=9.9m
.meas tran VB_Q1     FIND V(Q1B)    AT=9.9m
.meas tran VC_Q1     FIND V(Q1C)    AT=9.9m
.meas tran VE_Q2     FIND V(Q2E)    AT=9.9m
.meas tran VC_Q2     FIND V(Q2C)    AT=9.9m
.meas tran I_5V      FIND I(VJ3)    AT=9.9m
.meas tran T_BIAS_OK WHEN V(BIAS)=38 RISE=1
* evento 1: muone 250 p.e.
.meas tran PK_EV1    MAX  V(CMP_IN)  FROM=9.999m  TO=10.003m
.meas tran Q_EV1     MAX  V(CMP_Q)   FROM=9.999m  TO=10.003m
.meas tran TTL_EV1   MAX  V(TTL_OUT) FROM=9.999m  TO=10.003m
.meas tran RPI_EV1   MAX  V(RPI_GPIO)  FROM=9.999m  TO=10.003m
.meas tran W_Q_EV1   TRIG V(CMP_Q)   VAL=1.65 RISE=1 TD=9.99m TARG V(CMP_Q)   VAL=1.65 FALL=1 TD=9.99m
.meas tran W_TTL_EV1 TRIG V(TTL_OUT) VAL=2.5  RISE=1 TD=9.99m TARG V(TTL_OUT) VAL=2.5  FALL=1 TD=9.99m
.meas tran W_RPI_EV1 TRIG V(RPI_GPIO)  VAL=1.65 RISE=1 TD=9.99m TARG V(RPI_GPIO)  VAL=1.65  FALL=1 TD=9.99m
.meas tran D_RPI_EV1 TRIG V(CMP_Q)   VAL=1.65 RISE=1 TD=9.99m TARG V(RPI_GPIO)  VAL=1.65  RISE=1 TD=9.99m
* evento 2: dark count 1 p.e. (deve restare sotto soglia)
.meas tran PK_EV2    MAX  V(CMP_IN)  FROM=10.009m TO=10.013m
.meas tran Q_EV2     MAX  V(CMP_Q)   FROM=10.009m TO=10.013m
* evento 3: muone piccolo 40 p.e.
.meas tran PK_EV3    MAX  V(CMP_IN)  FROM=10.019m TO=10.0213m
.meas tran Q_EV3     MAX  V(CMP_Q)   FROM=10.019m TO=10.0213m
.meas tran RPI_EV3   MAX  V(RPI_GPIO)  FROM=10.019m TO=10.0215m
.meas tran W_Q_EV3   TRIG V(CMP_Q)   VAL=1.65 RISE=1 TD=10.019m TARG V(CMP_Q)  VAL=1.65 FALL=1 TD=10.019m
.meas tran W_RPI_EV3 TRIG V(RPI_GPIO)  VAL=1.65  RISE=1 TD=10.019m TARG V(RPI_GPIO) VAL=1.65 FALL=1 TD=10.019m
* evento 4: muone 150 p.e. a 1,5 us dal precedente
.meas tran Q_EV4     MAX  V(CMP_Q)   FROM=10.0215m TO=10.0225m
.meas tran RPI_EV4   MAX  V(RPI_GPIO)  FROM=10.0215m TO=10.0225m
* monostabile 555 + LED
.meas tran VA_LED    MAX  V(LED_A)  FROM=10m TO=12m
.meas tran VK_LED    MAX  V(LED_K)  FROM=10m TO=12m
.meas tran T_LED     TRIG V(LED_A) VAL=1.65 RISE=1 TD=9.99m TARG V(LED_A) VAL=1.65 FALL=1 TD=9.99m
.meas tran V_LED_OFF FIND V(LED_A)  AT=29m
.backanno
.end